# Altium project SingleChip-Rev2.PrjPcb (part 5 of 8)

## Sheet Power-1.SchDoc: =ProjectTitle
size A3; Author: Jaime I. Chait; Organization: NWES LLC; Address1: 111 SW 5th Ave, STE 3150; Address2: Portland, OR 97204; DocumentNumber: SCH-0001; Revision: 2; SheetNumber: 2; SheetTotal: 19
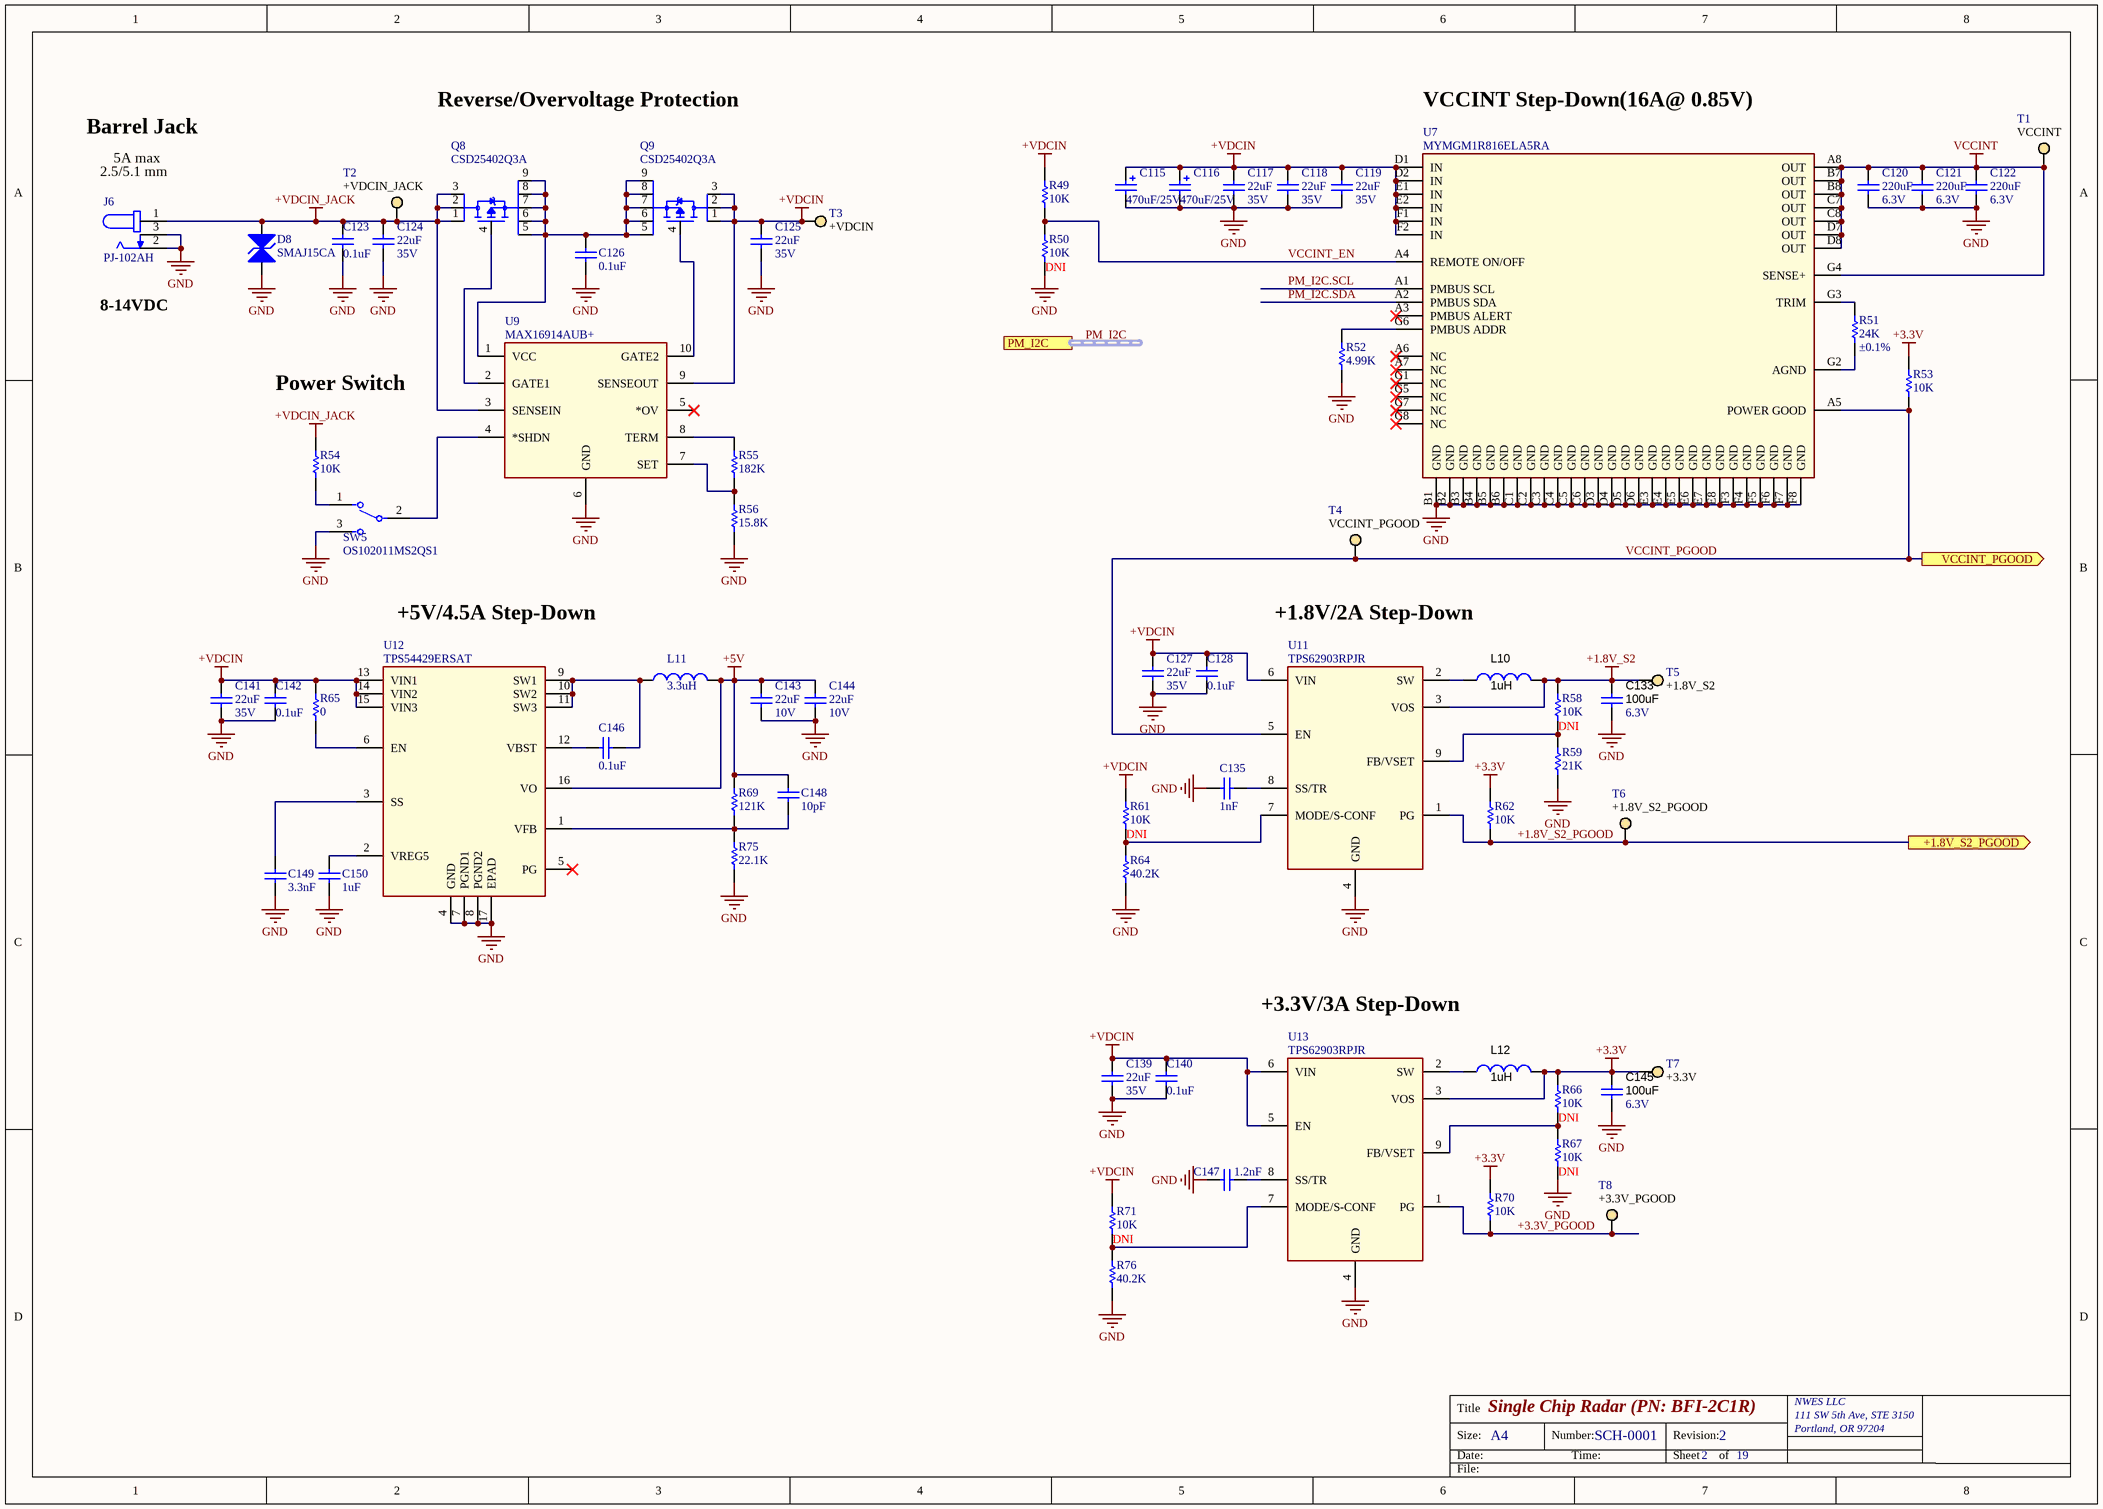
[diagram p11: Power-1.SchDoc]

### Parts
C115  470uF/25V  [Panasonic EEE Size G]
C116  470uF/25V  [Panasonic EEE Size G]
C117  22uF  Voltage Rating: 35V  [CAPC3216X180N]
C118  22uF  Voltage Rating: 35V  [CAPC3216X180N]
C119  22uF  Voltage Rating: 35V  [CAPC3216X180N]
C120  220uF  Voltage Rating (DC): 6.3V  [CAPC3216X180N]
C121  220uF  Voltage Rating (DC): 6.3V  [CAPC3216X180N]
C122  220uF  Voltage Rating (DC): 6.3V  [CAPC3216X180N]
C123  0.1uF  [CAPC1005X55USR]
C124  22uF  Voltage Rating: 35V  [CAPC3216X180N]
C125  22uF  Voltage Rating: 35V  [CAPC3216X180N]
C126  0.1uF  [CAPC1005X55USR]
C127  22uF  Voltage Rating: 35V  [CAPC3216X180N]
C128  0.1uF  [CAPC1005X55USR]
C133  100uF  Voltage Rating (DC): 6.3V  [CAPC3216X180N]
C135  1nF  [CAPC1005X55USR]
C139  22uF  Voltage Rating: 35V  [CAPC3216X180N]
C140  0.1uF  [CAPC1005X55USR]
C141  22uF  Voltage Rating: 35V  [CAPC3216X180N]
C142  0.1uF  [CAPC1005X55USR]
C143  22uF  Voltage Rating: 10V  [CAPC1608X100N]
C144  22uF  Voltage Rating: 10V  [CAPC1608X100N]
C145  100uF  Voltage Rating (DC): 6.3V  [CAPC3216X180N]
C146  0.1uF  [CAPC1005X55USR]
C147  1.2nF  [CAPC1005X55USR]
C148  10pF  [CAPC1005X55USR]
C149  3.3nF  [CAPC1005X55USR]
C150  1uF  [CAPC1005X55USR]
D8  SMAJ15CA  [DIODE DO-214AC(SMA)]
J6  PJ-102AH  [CUI_PJ-102AH]
L10  1uH  [DFE252012P]
L11  3.3uH  [IND_IHLP-3232DZ_VIS]
L12  1uH  [DFE252012P]
Q8  CSD25402Q3A  [8-VSONP (3x3.15)]
Q9  CSD25402Q3A  [8-VSONP (3x3.15)]
R49  10K  [RESC1005X40USR]
R50  10K  [RESC1005X40USR]
R51  24K  Tolerance: ±0.1%  [RESC1005X40USR]
R52  4.99K  [RESC1005X40USR]
R53  10K  [RESC1005X40USR]
R54  10K  [RESC1005X40USR]
R55  182K  [RESC1005X40USR]
R56  15.8K  [RESC1005X40USR]
R58  10K  [RESC1005X40USR]
R59  21K  [RESC1005X40USR]
R61  10K  [RESC1005X40USR]
R62  10K  [RESC1005X40USR]
R64  40.2K  [RESC1005X40USR]
R65  0  [RESC1005X40USR]
R66  10K  [RESC1005X40USR]
R67  10K  [RESC1005X40USR]
R69  121K  [RESC1005X40USR]
R70  10K  [RESC1005X40USR]
R71  10K  [RESC1005X40USR]
R75  22.1K  [RESC1005X40USR]
R76  40.2K  [RESC1005X40USR]
SW5  OS102011MS2QS1  [SW_OS102011MS2QS1]
T1  Parameter 1: VCCINT  [TP_SM_1MM]  (hidden comment: TP_S)  (no BOM)
T2  Parameter 1: +VDCIN_JACK  [TP_SM_1MM]  (hidden comment: TP_S)  (no BOM)
T3  Parameter 1: +VDCIN  [TP_SM_1MM]  (hidden comment: TP_S)  (no BOM)
T4  Parameter 1: VCCINT_PGOOD  [TP_SM_1MM]  (hidden comment: TP_S)  (no BOM)
T5  Parameter 1: +1.8V_S2  [TP_SM_1MM]  (hidden comment: TP_S)  (no BOM)
T6  Parameter 1: +1.8V_S2_PGOOD  [TP_SM_1MM]  (hidden comment: TP_S)  (no BOM)
T7  Parameter 1: +3.3V  [TP_SM_1MM]  (hidden comment: TP_S)  (no BOM)
T8  Parameter 1: +3.3V_PGOOD  [TP_SM_1MM]  (hidden comment: TP_S)  (no BOM)
U7  MYMGM1R816ELA5RA  [56-SMD Module]
U9  MAX16914AUB+  [10-TFSOP]
U11  TPS62903RPJR  [9-VQFN-HR (1.5x2)]
U12  TPS54429ERSAT  [16-QFN (4x4)]
U13  TPS62903RPJR  [9-VQFN-HR (1.5x2)]

### Ports
+1.8V_S2_PGOOD (out), PM_I2C (harness I2C), VCCINT_PGOOD (out)

### Nets
+1.8V_S2: C133.1 L10.2 R58.2 T5.1 U11.3(VOS)
+3.3V: C145.1 L12.2 R53.2 R62.2 R66.2 R70.2 T7.1 U13.3(VOS)
+5V: C143.1 C144.1 C148.2 L11.2 R69.2 U12.16(VO)
+VDCIN: C115.1 C116.1 C117.1 C118.1 C119.1 C125.1 C127.1 C128.2 C139.1 C140.2 C141.1 C142.2 Q9.1(D) Q9.2(D) Q9.3(D) R49.2 R61.2 R65.2 R71.2 T3.1 U7.D1(IN) U7.D2(IN) U7.E1(IN) U7.E2(IN) U7.F1(IN) U7.F2(IN) U9.9(SENSEOUT) U11.6(VIN) U12.13(VIN1) U12.14(VIN2) U12.15(VIN3) U13.5(EN) U13.6(VIN)
+VDCIN_JACK: C123.2 C124.1 D8.1 J6.1 Q8.1(D) Q8.2(D) Q8.3(D) R54.2 T2.1 U9.3(SENSEIN)
GND: C115.2 C116.2 C117.2 C118.2 C119.2 C120.2 C121.2 C122.2 C123.1 C124.2 C125.2 C126.1 C127.2 C128.1 C133.2 C135.1 C139.2 C140.1 C141.2 C142.1 C143.2 C144.2 C145.2 C147.1 C149.1 C150.1 D8.2 J6.2 J6.3 R50.1 R52.1 R56.1 R59.1 R64.1 R67.1 R75.1 R76.1 SW5.3 U7.B1(GND) U7.B2(GND) U7.B3(GND) U7.B4(GND) U7.B5(GND) U7.B6(GND) U7.C1(GND) U7.C2(GND) U7.C3(GND) U7.C4(GND) U7.C5(GND) U7.C6(GND) U7.D3(GND) U7.D4(GND) U7.D5(GND) U7.D6(GND) U7.E3(GND) U7.E4(GND) U7.E5(GND) U7.E6(GND) U7.E7(GND) U7.E8(GND) U7.F3(GND) U7.F4(GND) U7.F5(GND) U7.F6(GND) U7.F7(GND) U7.F8(GND) U9.6(GND) U11.4(GND) U12.4(GND) U12.7(PGND1) U12.8(PGND2) U12.17(EPAD) U13.4(GND)
VCCINT: C120.1 C121.1 C122.1 T1.1 U7.A8(OUT) U7.B7(OUT) U7.B8(OUT) U7.C7(OUT) U7.C8(OUT) U7.D7(OUT) U7.D8(OUT) U7.G4(SENSE+)
+1.8V_S2_PGOOD: R62.1 T6.1 U11.1(PG) ; port +1.8V_S2_PGOOD
+3.3V_PGOOD: R70.1 T8.1 U13.1(PG)
PM_I2C.SCL: U7.A1(PMBUS_SCL)
PM_I2C.SDA: U7.A2(PMBUS_SDA)
VCCINT_EN: R49.1 R50.2 U7.A4(REMOTE_ON/OFF)
VCCINT_PGOOD: R53.1 T4.1 U7.A5(POWER_GOOD) U11.5(EN) ; port VCCINT_PGOOD
NetC126_2: C126.2 Q8.5(S) Q8.6(S) Q8.7(S) Q8.8(S) Q8.9(S) Q9.5(S) Q9.6(S) Q9.7(S) Q9.8(S) Q9.9(S) U9.1(VCC)
NetC135_2: C135.2 U11.8(SS/TR)
NetC146_1: C146.1 L11.1 U12.9(SW1) U12.10(SW2) U12.11(SW3)
NetC146_2: C146.2 U12.12(VBST)
NetC147_2: C147.2 U13.8(SS/TR)
NetC148_1: C148.1 R69.1 R75.2 U12.1(VFB)
NetC149_2: C149.2 U12.3(SS)
NetC150_2: C150.2 U12.2(VREG5)
NetL10_1: L10.1 U11.2(SW)
NetL12_1: L12.1 U13.2(SW)
NetQ8_4: Q8.4(G) U9.2(GATE1)
NetQ9_4: Q9.4(G) U9.10(GATE2)
NetR51_1: R51.1 U7.G2(AGND)
NetR51_2: R51.2 U7.G3(TRIM)
NetR52_2: R52.2 U7.G6(PMBUS_ADDR)
NetR54_1: R54.1 SW5.1
NetR55_1: R55.1 R56.2 U9.7(SET)
NetR55_2: R55.2 U9.8(TERM)
NetR58_1: R58.1 R59.2 U11.9(FB/VSET)
NetR61_1: R61.1 R64.2 U11.7(MODE/S-CONF)
NetR65_1: R65.1 U12.6(EN)
NetR66_1: R66.1 R67.2 U13.9(FB/VSET)
NetR71_1: R71.1 R76.2 U13.7(MODE/S-CONF)
NetSW5_2: SW5.2 U9.4(*SHDN)

Not connected (* = marked no-connect by the designer): U7 A3(PMBUS_ALERT)* A6(NC)* A7(NC)* G1(NC)* G5(NC)* G7(NC)* G8(NC)*; U9 5(*OV)*; U12 5(PG)*

### Buses and harness runs
harness PM_I2C = port PM_I2C

### Notes on the sheet
- Reverse/Overvoltage Protection
- VCCINT Step-Down(16A@ 0.85V)
- Barrel Jack
- (near J6) 2.5/5.1 mm
- 5A max
- (near J6) 8-14VDC
- (near R50) DNI
- Power Switch
- +5V/4.5A Step-Down
- +1.8V/2A Step-Down
- (near R58) DNI
- (near R61) DNI
- +3.3V/3A Step-Down
- (near R66) DNI
- (near R67) DNI
- (near R71) DNI
- Title
- Size:
- Date:
- A4
- Number:
- Time:
- Revision:
- Sheet
- of
- File:

### Library data of the parts
C115 C116 = CAP ALUM POLY 470UF 20% 25V SMD: Conductive Polymer Hybrid Aluminum Electrolytic Capacitors, 470µF, 25V, -55 to 125¡C; Manufacturer: Panasonic; Manufacturer Part Number: EEHZK1E471P; Capacitance: 470uF; Tolerance: 20%; ESR (Equivalent Series Resistance): 20mR; Life (Hours): 4000Hour; Supplier 1: Newark; RoHS: Yes; Category: Aluminum Electrolytic Capacitors; Stock 1: 9500; Pricing 1: 1=1.20000, 500=1.20000 (USD); Mount: Surface Mount; Case/Package: Radial; Min Operating Temperature: -55°C; Max Operating Temperature: 125°C; Resistor Type: Hybrid; Packaging: Cut Tape; Voltage Rating: 25V; Ratings: AEC-Q200; RoHS Compliant: Yes; ComponentLink1URL: https://industrial.panasonic.com/cdbs/www-data/pdf/RDD0000/DMD0000COL81.pdf?src-supplier=Digi-Key; ComponentLink1Description: https://industrial.panasonic.com/cdbs/www-data/pdf/RDD0000/DMD0000COL81.pdf?src-supplier=Digi-Key; ComponentLink2URL: https://industrial.panasonic.com/cdbs/www-data/pdf/RDD0000/ABA0000C1229.pdf?src-supplier=Digi-Key; ComponentLink2Description: https://industrial.panasonic.com/cdbs/www-data/pdf/RDD0000/ABA0000C1229.pdf?src-supplier=Digi-Key; ComponentLink3URL: http://industrial.panasonic.com/cdbs/www-data/pdf/RDD0000/ABA0000C1229.pdf?src-supplier=Farnell; ComponentLink3Description: http://industrial.panasonic.com/cdbs/www-data/pdf/RDD0000/ABA0000C1229.pdf?src-supplier=Farnell; Supplier Part Number 1: 65AH6364
C117-C119 C124 C125 C127 C139 C141 = CAP CER 22UF 35V X5R 1206: C Series 1206 22 uF 35 V ±20 % Tolerance X5R SMT Multilayer Ceramic Capacitor; Manufacturer: TDK; Manufacturer Part Number: C3216X5R1V226M160AC; Tolerance: 20%; Supplier 1: Digi-Key; RoHS: Yes; Category: Ceramic Capacitors; Stock 1: 1100049; Pricing 1: 1=0.95000, 10=0.72200, 50=0.60000, 100=0.51660, 500=0.39996, 1000=0.34441 (USD); Mount: Surface Mount; Case/Package: 1206; Case Code (Metric): 3216; Case Code (Imperial): 1206; Weight: 0.000571oz; Dielectric Material: Ceramic; Min Operating Temperature: -55°C; Max Operating Temperature: 85°C; Capacitance: 22uF; Packaging: Tape and Reel; Termination: SMD/SMT; Series: C; Package Quantity: 2000; Voltage Rating (DC): 35V; Dielectric: X5R; Resistor Type: Ceramic; Voltage: 35V; Construction: Flat; Length: 3.2mm; Width: 0.063inch; Height: 1.6mm; Depth: 1.6mm; Thickness: 1.6mm; Radiation Hardening: No; Lead Free: Lead Free; RoHS Compliant: Yes; ComponentLink1URL: https://datasheet.ciiva.com/24216/c3216x5r1v226m160ac-265035-24216573.pdf?src-supplier=Mouser; ComponentLink1Description: https://datasheet.ciiva.com/24216/c3216x5r1v226m160ac-265035-24216573.pdf?src-supplier=Mouser; ComponentLink2URL: https://datasheet.ciiva.com/23803/1796654-23803046.pdf?src-supplier=Newark; ComponentLink2Description: https://datasheet.ciiva.com/23803/1796654-23803046.pdf?src-supplier=Newark; ComponentLink3URL: https://datasheet.ciiva.com/22725/1913358-22725591.pdf?src-supplier=Element14; ComponentLink3Description: https://datasheet.ciiva.com/22725/1913358-22725591.pdf?src-supplier=Element14; ComponentLink4URL: https://datasheet.ciiva.com/22725/1913358-22725592.pdf?src-supplier=Element14; ComponentLink4Description: https://datasheet.ciiva.com/22725/1913358-22725592.pdf?src-supplier=Element14; ComponentLink5URL: https://datasheet.ciiva.com/6259/tdkmlcccaprange-6259231.pdf?src-supplier=Digi-Key; ComponentLink5Description: https://datasheet.ciiva.com/6259/tdkmlcccaprange-6259231.pdf?src-supplier=Digi-Key; Supplier Part Number 1: 445-8045-1-ND
C120-C122 = CAP CER 220UF 6.3V X5R 1206: 1206 220 uF 6.3 V ±20% Tolernace X5R Multilayer Ceramic Capacitor; Manufacturer: Murata; Manufacturer Part Number: GRM31CR60J227ME11L; Supplier 1: Digi-Key; RoHS: Yes; Category: Ceramic Capacitors; Stock 1: 642908; Pricing 1: 1=1.15000, 10=0.90900, 50=0.78780, 100=0.68180, 500=0.51516, 1000=0.45455 (USD); Mount: Surface Mount; Case/Package: 1206; Case Code (Metric): 3216; Case Code (Imperial): 1206; Min Operating Temperature: -55°C; Max Operating Temperature: 85°C; Packaging: Cut Tape; Voltage Rating: 6.3V; Dielectric: X5R; Tolerance: 20%; Capacitance: 220uF; Series: GRM; Length: 0.126inch; Width: 0.063inch; Thickness: 0.075inch; Reach SVHC Compliant: Yes; RoHS Compliant: Yes; ComponentLink1URL: http://www.farnell.com/datasheets/2867879.pdf?src-supplier=Farnell; ComponentLink1Description: http://www.farnell.com/datasheets/2867879.pdf?src-supplier=Farnell; ComponentLink2URL: http://www.farnell.com/datasheets/2867879.pdf?src-supplier=Element14; ComponentLink2Description: http://www.farnell.com/datasheets/2867879.pdf?src-supplier=Element14; ComponentLink3URL: http://search.murata.co.jp/Ceramy/image/img/A01X/G101/ENG/GRM31CR60J227ME11-01.pdf?src-supplier=Digi-Key; ComponentLink3Description: http://search.murata.co.jp/Ceramy/image/img/A01X/G101/ENG/GRM31CR60J227ME11-01.pdf?src-supplier=Digi-Key; ComponentLink4URL: http://search.murata.co.jp/Ceramy/image/img/A01X/partnumbering_e_01.pdf?src-supplier=Digi-Key; ComponentLink4Description: http://search.murata.co.jp/Ceramy/image/img/A01X/partnumbering_e_01.pdf?src-supplier=Digi-Key; ComponentLink5URL: http://www.farnell.com/datasheets/1957826.pdf?src-supplier=Newark; ComponentLink5Description: http://www.farnell.com/datasheets/1957826.pdf?src-supplier=Newark; Supplier Part Number 1: 490-13970-1-ND
C123 C126 C128 C140 C142 C146 = CAP CER 0.1UF 25V X5R 0402: Manufacturer Part Number: CL05A104KA5NNNC; Manufacturer: Samsung Electro-Mechanics; Supplier Part Number 1: 1276-1043-1-ND; Package: 0402; Height: 0.55mm; Supplier 1: Digi-Key; value: 0.1uF
C133 C145 = CAP CER 100UF 6.3V X5R 1206: 1206 100 uF 6.3 V ±20% Tolerance X5R SMT Multilayer Ceramic Capacitor; Manufacturer: Murata; Manufacturer Part Number: GRM31CR60J107ME39L; Supplier 1: Mouser; RoHS: Yes; Category: Ceramic Capacitors; Stock 1: 589630; Pricing 1: 1=1.08000, 10=0.79300, 50=0.79300, 100=0.54400, 1000=0.53900, 10000=0.44000 (USD); Mount: Surface Mount; Case/Package: 1206; Case Code (Metric): 3216; Case Code (Imperial): 1206; Min Operating Temperature: -55°C; Max Operating Temperature: 85°C; Packaging: Cut Tape; Voltage Rating: 6.3V; Dielectric: X5R; Tolerance: 20%; Capacitance: 100uF; Series: GRM; Length: 3.2mm; Width: 1.6mm; Thickness: 0.071inch; Reach SVHC Compliant: Yes; RoHS Compliant: Yes; ComponentLink1URL: https://datasheet.ciiva.com/142/grm31cr60j107me39-01-142571.pdf?src-supplier=Digi-Key; ComponentLink1Description: https://datasheet.ciiva.com/142/grm31cr60j107me39-01-142571.pdf?src-supplier=Digi-Key; ComponentLink2URL: https://datasheet.ciiva.com/142/grm31cr60j107me39-01-142572.pdf?src-supplier=Digi-Key; ComponentLink2Description: https://datasheet.ciiva.com/142/grm31cr60j107me39-01-142572.pdf?src-supplier=Digi-Key; ComponentLink3URL: https://datasheet.ciiva.com/3776/255grm31cr60j107me3923-3776999.pdf?src-supplier=Arrow+Electronics; ComponentLink3Description: https://datasheet.ciiva.com/3776/255grm31cr60j107me3923-3776999.pdf?src-supplier=Arrow+Electronics; ComponentLink4URL: https://datasheet.ciiva.com/11787/0900766b80ef921d-11787809.pdf?src-supplier=Rs; ComponentLink4Description: https://datasheet.ciiva.com/11787/0900766b80ef921d-11787809.pdf?src-supplier=Rs; ComponentLink5URL: https://datasheet.ciiva.com/29202/451152-da-01-de-vs-chip-kond-1206-100-0-uf-20pr-6-3v-x5r-29202463.pdf?src-supplier=Conrad; ComponentLink5Description: https://datasheet.ciiva.com/29202/451152-da-01-de-vs-chip-kond-1206-100-0-uf-20pr-6-3v-x5r-29202463.pdf?src-supplier=Conrad; Supplier Part Number 1: 81-GRM31CR60J107ME9L; Material: Ceramic; Weight: 0.001411oz; Package Quantity: 2000; Termination: Standard; Voltage: 6.3V; Height: 1.6mm; Depth: 1.6mm; Radiation Hardening: No; Lead Free: Lead Free; ComponentLink6URL: https://datasheet.ciiva.com/29199/454804-da-01-en-vs-kondensator-1206-29199543.pdf?src-supplier=Conrad; ComponentLink6Description: https://datasheet.ciiva.com/29199/454804-da-01-en-vs-kondensator-1206-29199543.pdf?src-supplier=Conrad; ComponentLink7URL: https://datasheet.ciiva.com/14116/grmseries-highdielectrictype-eng-14116431.pdf?src-supplier=Distrelec; ComponentLink7Description: https://datasheet.ciiva.com/14116/grmseries-highdielectrictype-eng-14116431.pdf?src-supplier=Distrelec; ComponentLink8URL: https://datasheet.ciiva.com/142/grm31cr60j107me39-01-142570.pdf?src-supplier=Digi-Key; ComponentLink8Description: https://datasheet.ciiva.com/142/grm31cr60j107me39-01-142570.pdf?src-supplier=Digi-Key; ComponentLink9URL: https://datasheet.ciiva.com/5416/product-5416441.pdf?src-supplier=Mouser; ComponentLink9Description: https://datasheet.ciiva.com/5416/product-5416441.pdf?src-supplier=Mouser; ComponentLink10URL: https://datasheet.ciiva.com/16461/product-16461259.pdf?src-supplier=Future+Electronics; ComponentLink10Description: https://datasheet.ciiva.com/16461/product-16461259.pdf?src-supplier=Future+Electronics
C135 = CAP CER 1000PF 50V C0G/NP0 0402: 0402 1000 pF 50 V ±5% Tolerance C0G Multilayer Ceramic Chip Capacitor; Manufacturer: Murata; Manufacturer Part Number: GRM1555C1H102JA01D; Voltage Rating: 50V; Insulation Resistance: 10GR; Temperature Coefficient: 30ppm/°C; Supplier 1: Digi-Key; RoHS: Yes; Category: Ceramic Capacitors; Stock 1: 27788485; Pricing 1: 1=0.10000, 10=0.03900, 50=0.02120, 100=0.01740, 500=0.01240, 1000=0.00975, 2500=0.00886, 5000=0.00815 (USD); Mount: Surface Mount; Case/Package: 0402; Number of Pins: 2; Case Code (Metric): 1005; Case Code (Imperial): 0402; Material: Ceramic; Dielectric Material: Ceramic; Min Operating Temperature: -55°C; Max Operating Temperature: 125°C; Package Quantity: 1; Capacitance: 1nF; Tolerance: 5%; Packaging: Tape and Reel; Voltage Rating (DC): 50V; Dielectric: C0G; Termination: SMD/SMT; Voltage: 50V; Series: GRM; Construction: Flat; Length: 1mm; Width: 0.5mm; Height: 0.5mm; Thickness: 0.022inch; Depth: 0.5mm; Size: 0.5mm; Radiation Hardening: No; Reach SVHC Compliant: Yes; Lead Free: Lead Free; RoHS Compliant: Yes; ComponentLink1URL: https://datasheet.ciiva.com/34302/1855908-34302849.pdf?src-supplier=Jameco; ComponentLink1Description: https://datasheet.ciiva.com/34302/1855908-34302849.pdf?src-supplier=Jameco; ComponentLink2URL: https://datasheet.ciiva.com/132/product-132800.pdf?src-supplier=Digi-Key; ComponentLink2Description: https://datasheet.ciiva.com/132/product-132800.pdf?src-supplier=Digi-Key; ComponentLink3URL: https://datasheet.ciiva.com/132/grm1555c1h102ja01-01-132799.pdf?src-supplier=Digi-Key; ComponentLink3Description: https://datasheet.ciiva.com/132/grm1555c1h102ja01-01-132799.pdf?src-supplier=Digi-Key; ComponentLink4URL: https://datasheet.ciiva.com/11786/0900766b807a1cab-11786727.pdf?src-supplier=RSComponents; ComponentLink4Description: https://datasheet.ciiva.com/11786/0900766b807a1cab-11786727.pdf?src-supplier=RSComponents; ComponentLink5URL: https://datasheet.ciiva.com/29200/453569-da-01-en-vs-kondensator-0402-29200121.pdf?src-supplier=Conrad; ComponentLink5Description: https://datasheet.ciiva.com/29200/453569-da-01-en-vs-kondensator-0402-29200121.pdf?src-supplier=Conrad; ComponentLink6URL: https://datasheet.ciiva.com/7828/4360-7828821.pdf?src-supplier=Element14; ComponentLink6Description: https://datasheet.ciiva.com/7828/4360-7828821.pdf?src-supplier=Element14; ComponentLink7URL: https://datasheet.ciiva.com/14116/grmseries-tc-hitype-eng-14116919.pdf?src-supplier=Distrelec; ComponentLink7Description: https://datasheet.ciiva.com/14116/grmseries-tc-hitype-eng-14116919.pdf?src-supplier=Distrelec; ComponentLink8URL: https://datasheet.ciiva.com/14116/grmseries-tc-hitype-eng-14116858.pdf?src-supplier=Distrelec; ComponentLink8Description: https://datasheet.ciiva.com/14116/grmseries-tc-hitype-eng-14116858.pdf?src-supplier=Distrelec; ComponentLink9URL: https://datasheet.ciiva.com/132/grm1555c1h102ja01-01-132801.pdf?src-supplier=Digi-Key; ComponentLink9Description: https://datasheet.ciiva.com/132/grm1555c1h102ja01-01-132801.pdf?src-supplier=Digi-Key; ComponentLink10URL: https://datasheet.ciiva.com/7828/1747436-7828822.pdf?src-supplier=Element14; ComponentLink10Description: https://datasheet.ciiva.com/7828/1747436-7828822.pdf?src-supplier=Element14; Supplier Part Number 1: 490-3244-1-ND
C143 C144 = CAP CER 22UF 10V X5R 0603: Multilayer Ceramic Capacitor, 22 uF, 10 V, ± 20%, X5R, 0603 [1608 Metric]; Manufacturer: TDK; Manufacturer Part Number: C1608X5R1A226M080AC; Supplier 1: Digi-Key; RoHS: Yes; Category: Ceramic Capacitors; Stock 1: 4100481; Pricing 1: 1=0.45000, 10=0.31300, 50=0.21920, 100=0.18790, 500=0.14090, 1000=0.11898 (USD); Mount: Surface Mount; Case/Package: 0603; Case Code (Metric): 1608; Case Code (Imperial): 0603; Dielectric Material: Ceramic; Weight: 7.1E-05oz; Min Operating Temperature: -55°C; Max Operating Temperature: 85°C; Tolerance: 20%; Capacitance: 22uF; Packaging: Tape and Reel; Voltage Rating (DC): 10V; Termination: SMD/SMT; Series: C; Package Quantity: 4000; Dielectric: X5R; Resistor Type: Ceramic; Length: 1.6mm; Width: 0.8mm; Height: 0.8mm; Thickness: 0.035inch; Depth: 0.8mm; Reach SVHC Compliant: Yes; Lead Free: Lead Free; RoHS Compliant: Yes; ComponentLink1URL: https://datasheet.ciiva.com/6274/tdkmlcccaprange-6274860.pdf?src-supplier=Digi-Key; ComponentLink1Description: https://datasheet.ciiva.com/6274/tdkmlcccaprange-6274860.pdf?src-supplier=Digi-Key; ComponentLink2URL: https://datasheet.ciiva.com/6274/tdkmlcccaprange-6274859.pdf?src-supplier=Digi-Key; ComponentLink2Description: https://datasheet.ciiva.com/6274/tdkmlcccaprange-6274859.pdf?src-supplier=Digi-Key; ComponentLink3URL: https://datasheet.ciiva.com/6274/tdkmlcccaprange-6274861.pdf?src-supplier=Digi-Key; ComponentLink3Description: https://datasheet.ciiva.com/6274/tdkmlcccaprange-6274861.pdf?src-supplier=Digi-Key; ComponentLink4URL: https://datasheet.ciiva.com/24216/mlcc-commercial-general-en-24216575.pdf?src-supplier=Mouser; ComponentLink4Description: https://datasheet.ciiva.com/24216/mlcc-commercial-general-en-24216575.pdf?src-supplier=Mouser; Supplier Part Number 1: 445-9077-1-ND
C147 = CAP CER 1200PF 50V X7R 0402: 0402 1.2 nF 50 V ±10% Tolerance X7R SMT Multilayer Ceramic Capacitor; Manufacturer: Murata; Manufacturer Part Number: GRM155R71H122KA01D; Voltage Rating: 50V; Supplier 1: Digi-Key; RoHS: Yes; Category: Ceramic Capacitors; Stock 1: 373559; Pricing 1: 1=0.10000, 10=0.02800, 50=0.01520, 100=0.01240, 500=0.00886, 1000=0.00696, 2500=0.00632, 5000=0.00582 (USD); Mount: Surface Mount; Case/Package: 0402; Case Code (Metric): 1005; Case Code (Imperial): 0402; Material: Ceramic; Min Operating Temperature: -55°C; Max Operating Temperature: 125°C; Capacitance: 1.2nF; Tolerance: 10%; Dielectric: X7R; Packaging: Tape and Reel; Package Quantity: 1; Voltage Rating (DC): 50V; Termination: SMD/SMT; Voltage: 50V; Series: GRM; Construction: Flat; Length: 1mm; Width: 0.5mm; Height: 0.5mm; Thickness: 0.022inch; Depth: 0.5mm; Radiation Hardening: No; Lead Free: Lead Free; RoHS Compliant: Yes; ComponentLink1URL: https://datasheet.ciiva.com/18184/getdatasheetpartid-220777-18184722.pdf?src-supplier=Verical; ComponentLink1Description: https://datasheet.ciiva.com/18184/getdatasheetpartid-220777-18184722.pdf?src-supplier=Verical; ComponentLink2URL: https://datasheet.ciiva.com/161/partnumbering-e-01-161460.pdf?src-supplier=Digi-Key; ComponentLink2Description: https://datasheet.ciiva.com/161/partnumbering-e-01-161460.pdf?src-supplier=Digi-Key; ComponentLink3URL: https://datasheet.ciiva.com/161/partnumbering-e-01-161459.pdf?src-supplier=Digi-Key; ComponentLink3Description: https://datasheet.ciiva.com/161/partnumbering-e-01-161459.pdf?src-supplier=Digi-Key; ComponentLink4URL: https://datasheet.ciiva.com/161/partnumbering-e-01-161461.pdf?src-supplier=Digi-Key; ComponentLink4Description: https://datasheet.ciiva.com/161/partnumbering-e-01-161461.pdf?src-supplier=Digi-Key; ComponentLink5URL: https://datasheet.ciiva.com/2989/product-2989402.pdf?src-supplier=Avnet; ComponentLink5Description: https://datasheet.ciiva.com/2989/product-2989402.pdf?src-supplier=Avnet; Supplier Part Number 1: 490-1304-1-ND
C148 = CAP CER 10PF 50V C0G/NP0 0402: 0402 10 pF 50 V ±5% Tolerance C0G SMT Multilayer Ceramic Capacitor; Manufacturer: Murata; Manufacturer Part Number: GRM1555C1H100JA01D; Voltage Rating: 50V; Temperature Coefficient: 30ppm/°C; Supplier 1: Digi-Key; RoHS: Yes; Category: Ceramic Capacitors; Stock 1: 7638732; Pricing 1: 1=0.10000, 10=0.02200, 50=0.01220, 100=0.00990, 500=0.00708, 1000=0.00556, 2500=0.00505, 5000=0.00465 (USD); Mount: Surface Mount; Case/Package: 0402; Number of Pins: 2; Case Code (Metric): 1005; Case Code (Imperial): 0402; Material: Ceramic; Min Operating Temperature: -55°C; Max Operating Temperature: 125°C; Capacitance: 10pF; Dielectric: C0G; Packaging: Tape and Reel; Package Quantity: 1; Voltage Rating (DC): 50V; Termination: SMD/SMT; Series: GRM; Tolerance: 5%; Voltage: 50V; Construction: Flat; Length: 1mm; Width: 0.02inch; Height: 0.5mm; Thickness: 0.022inch; Depth: 0.5mm; Radiation Hardening: No; RoHS Compliant: Yes; Lead Free: Lead Free; Reach SVHC Compliant: Yes; ComponentLink1URL: https://datasheet.ciiva.com/2989/product-2989280.pdf?src-supplier=Avnet; ComponentLink1Description: https://datasheet.ciiva.com/2989/product-2989280.pdf?src-supplier=Avnet; ComponentLink2URL: https://datasheet.ciiva.com/18184/getdatasheetpartid-307234-18184164.pdf?src-supplier=Verical; ComponentLink2Description: https://datasheet.ciiva.com/18184/getdatasheetpartid-307234-18184164.pdf?src-supplier=Verical; ComponentLink3URL: https://datasheet.ciiva.com/29200/453545-da-01-en-vs-kondensator-0402-29200107.pdf?src-supplier=Conrad; ComponentLink3Description: https://datasheet.ciiva.com/29200/453545-da-01-en-vs-kondensator-0402-29200107.pdf?src-supplier=Conrad; ComponentLink4URL: https://datasheet.ciiva.com/7828/1666664-7828812.pdf?src-supplier=Element14; ComponentLink4Description: https://datasheet.ciiva.com/7828/1666664-7828812.pdf?src-supplier=Element14; ComponentLink5URL: https://datasheet.ciiva.com/6271/partnumbering-e-01-6271159.pdf?src-supplier=Digi-Key; ComponentLink5Description: https://datasheet.ciiva.com/6271/partnumbering-e-01-6271159.pdf?src-supplier=Digi-Key; ComponentLink6URL: https://datasheet.ciiva.com/6271/partnumbering-e-01-6271158.pdf?src-supplier=Digi-Key; ComponentLink6Description: https://datasheet.ciiva.com/6271/partnumbering-e-01-6271158.pdf?src-supplier=Digi-Key; ComponentLink7URL: https://datasheet.ciiva.com/6271/partnumbering-e-01-6271068.pdf?src-supplier=Digi-Key; ComponentLink7Description: https://datasheet.ciiva.com/6271/partnumbering-e-01-6271068.pdf?src-supplier=Digi-Key; ComponentLink8URL: https://datasheet.ciiva.com/48671/product-48671350.pdf?src-supplier=Avnet; ComponentLink8Description: https://datasheet.ciiva.com/48671/product-48671350.pdf?src-supplier=Avnet; Supplier Part Number 1: 490-5921-1-ND
C149 = CAP CER 3300PF 50V X7R 0402: 0402 3.3 nF 50 V ±10% Tolerance X7R SMT Multilayer Ceramic Capacitor; Manufacturer: Murata; Manufacturer Part Number: GRM155R71H332KA01D; Voltage Rating (DC): 50V; Dissipation Factor: 0.025%; Insulation Resistance: 10GR; Supplier 1: Digi-Key; RoHS: Yes; Category: Ceramic Capacitors; Stock 1: 1429301; Pricing 1: 1=0.10000, 10=0.02800, 50=0.01520, 100=0.01240, 500=0.00886, 1000=0.00696, 2500=0.00632, 5000=0.00582 (USD); Mount: Surface Mount; Case/Package: 0402; Case Code (Metric): 1005; Case Code (Imperial): 0402; Material: Ceramic; Min Operating Temperature: -55°C; Max Operating Temperature: 125°C; Capacitance: 3.3nF; Tolerance: 10%; Package Quantity: 1; Packaging: Tape and Reel; Voltage Rating: 50V; Dielectric: X7R; Termination: SMD/SMT; Voltage: 50V; Series: GRM; Construction: Flat; Length: 1mm; Width: 0.02inch; Height: 0.5mm; Thickness: 0.022inch; Depth: 0.5mm; Radiation Hardening: No; Reach SVHC Compliant: Yes; Lead Free: Lead Free; RoHS Compliant: Yes; ComponentLink1URL: https://datasheet.ciiva.com/129/grm155r71h332ka01-01-129766.pdf?src-supplier=Digi-Key; ComponentLink1Description: https://datasheet.ciiva.com/129/grm155r71h332ka01-01-129766.pdf?src-supplier=Digi-Key; ComponentLink2URL: https://datasheet.ciiva.com/129/grm155r71h332ka01-01-129767.pdf?src-supplier=Digi-Key; ComponentLink2Description: https://datasheet.ciiva.com/129/grm155r71h332ka01-01-129767.pdf?src-supplier=Digi-Key; ComponentLink3URL: https://datasheet.ciiva.com/11789/0900766b80ef921d-11789161.pdf?src-supplier=RSComponents; ComponentLink3Description: https://datasheet.ciiva.com/11789/0900766b80ef921d-11789161.pdf?src-supplier=RSComponents; ComponentLink4URL: https://datasheet.ciiva.com/5422/product-5422403.pdf?src-supplier=Mouser; ComponentLink4Description: https://datasheet.ciiva.com/5422/product-5422403.pdf?src-supplier=Mouser; ComponentLink5URL: https://datasheet.ciiva.com/18184/getdatasheetpartid-149678-18184747.pdf?src-supplier=Verical; ComponentLink5Description: https://datasheet.ciiva.com/18184/getdatasheetpartid-149678-18184747.pdf?src-supplier=Verical; ComponentLink6URL: https://datasheet.ciiva.com/29199/454326-da-01-en-vs-kondensator-0402-29199651.pdf?src-supplier=Conrad; ComponentLink6Description: https://datasheet.ciiva.com/29199/454326-da-01-en-vs-kondensator-0402-29199651.pdf?src-supplier=Conrad; ComponentLink7URL: https://datasheet.ciiva.com/14116/grmseries-highdielectrictype-eng-14116909.pdf?src-supplier=Distrelec; ComponentLink7Description: https://datasheet.ciiva.com/14116/grmseries-highdielectrictype-eng-14116909.pdf?src-supplier=Distrelec; ComponentLink8URL: https://datasheet.ciiva.com/2989/product-2989413.pdf?src-supplier=Avnet; ComponentLink8Description: https://datasheet.ciiva.com/2989/product-2989413.pdf?src-supplier=Avnet; ComponentLink9URL: https://datasheet.ciiva.com/16199/product-16199259.pdf?src-supplier=Future+Electronics; ComponentLink9Description: https://datasheet.ciiva.com/16199/product-16199259.pdf?src-supplier=Future+Electronics; ComponentLink10URL: https://datasheet.ciiva.com/48671/product-48671326.pdf?src-supplier=Avnet; ComponentLink10Description: https://datasheet.ciiva.com/48671/product-48671326.pdf?src-supplier=Avnet; Supplier Part Number 1: 490-3248-1-ND
C150 = CAP CER 1UF 25V X5R 0402: Manufacturer Part Number: GRM155R61E105MA12D; Manufacturer: Murata Electronics; Part #: E-CAP-042; Supplier Part Number 1: 490-10018-1-ND; Package: 0402; value: 1uF; Supplier 1: Digi-Key; Height: 0.55mm; ComponentLink1Description: New link; ComponentLink1URL: *
D8 = D_TVS_SMAJ15CA: Diode TVS Single Uni-Dir/Bi-Dir 15V 400W 2-Pin SMA Carrier T/R; Manufacturer: Littelfuse; Polarity: Bidirectional; Clamping Voltage: 24.4V; Breakdown Voltage: 16.7V; Peak Pulse Current: 16.4A; Test Current: 1mA; Number of Elements: 1; Max Power Dissipation: 3.3W; Leakage Current: 1uA; Power Line Protection: No; Diode Type: ZENER; Max Breakdown Voltage: 18.5V; Supplier 1: Digi-Key; Manufacturer Part Number: SMAJ15CA; RoHS: Yes; Category: TVS Diodes; Stock 1: 491414; Pricing 1: 1=0.43000, 10=0.32000, 100=0.19950, 500=0.13650, 1000=0.10500, 2000=0.09450 (USD); Mount: Surface Mount; Case/Package: DO-214AC; Number of Pins: 2; Min Operating Temperature: -65°C; Max Operating Temperature: 150°C; Packaging: Tape and Reel; Peak Pulse Power: 400W; Reverse Standoff Voltage: 15V; Max Surge Current: 16.4A; Package Quantity: 5000; Min Breakdown Voltage: 16.7V; Operating Supply Voltage: 15V; Reverse Breakdown Voltage: 16.7V; Direction: Bidirectional; Number of Channels: 1; Termination: SMD/SMT; Number of Bidirectional Channels: 1; Max Reverse Leakage Current: 1uA; Element Configuration: Single; Voltage Rating (DC): 15V; Resistor Type: Zener; Series: SMAJ; Power Dissipation: 400W; Clamping Voltage-Max: 24.4V; Length: 4.5mm; Width: 2.79mm; Height: 2.087mm; Radiation Hardening: No; RoHS Compliant: Yes; Lead Free: Lead Free; Reach SVHC Compliant: Yes; ComponentLink1URL: https://datasheet.ciiva.com/25624/0900766b810f4edb-25624840.pdf?src-supplier=RSComponents; ComponentLink1Description: https://datasheet.ciiva.com/25624/0900766b810f4edb-25624840.pdf?src-supplier=RSComponents; ComponentLink2URL: https://datasheet.ciiva.com/331/littelfuse-tvs-diode-smaj-datasheet-pdf-331084.pdf?src-supplier=Digi-Key; ComponentLink2Description: https://datasheet.ciiva.com/331/littelfuse-tvs-diode-smaj-datasheet-pdf-331084.pdf?src-supplier=Digi-Key; ComponentLink3URL: https://datasheet.ciiva.com/331/littelfuse-tvs-diode-smaj-datasheet-pdf-331085.pdf?src-supplier=Digi-Key; ComponentLink3Description: https://datasheet.ciiva.com/331/littelfuse-tvs-diode-smaj-datasheet-pdf-331085.pdf?src-supplier=Digi-Key; ComponentLink4URL: https://datasheet.ciiva.com/331/littelfuse-tvs-diode-smaj-datasheet-pdf-331086.pdf?src-supplier=Digi-Key; ComponentLink4Description: https://datasheet.ciiva.com/331/littelfuse-tvs-diode-smaj-datasheet-pdf-331086.pdf?src-supplier=Digi-Key; ComponentLink5URL: https://datasheet.ciiva.com/16487/littelfuse-tvs-diode-smaj-16487445.pdf?src-supplier=Future+Electronics; ComponentLink5Description: https://datasheet.ciiva.com/16487/littelfuse-tvs-diode-smaj-16487445.pdf?src-supplier=Future+Electronics; ComponentLink6URL: https://datasheet.ciiva.com/8062/littelfuse-tvs-diode-smaj-8062270.pdf?src-supplier=Element14; ComponentLink6Description: https://datasheet.ciiva.com/8062/littelfuse-tvs-diode-smaj-8062270.pdf?src-supplier=Element14; ComponentLink7URL: https://datasheet.ciiva.com/28473/607617-28473388.pdf?src-supplier=Element14; ComponentLink7Description: https://datasheet.ciiva.com/28473/607617-28473388.pdf?src-supplier=Element14; Supplier Part Number 1: SMAJ15CALFCT-ND
J6 = PJ-102AH: 2.0 x 6.5 mm, 5.0 A, Horizontal, Through Hole, Tapered Pins, Dc Power Jack Connector; Manufacturer: CUI; Gender: Male; Shielding: Unshielded; Current Rating: 5A; Voltage Rating: 24V; Insulation Resistance: 50MR; Number of Conductors: 2; Supplier 1: Digi-Key; Manufacturer Part Number: PJ-102AH; RoHS: Yes; Category: Uncategorized; Stock 1: 24375; Pricing 1: 1=0.810000, 10=0.686000, 25=0.658000, 40=0.644000, 80=0.616000, 280=0.560000, 560=0.504000, 1120=0.448000, 2520=0.406000 (USD); Mount: Through Hole; Color: Black; Contact Material: Copper; Contact Plating: Nickel; Housing Color: Black; Housing Material: Thermoplastic; Min Operating Temperature: -25°C; Max Operating Temperature: 85°C; Package Quantity: 280; Termination: Through Hole; Connector Type: Jack; Contact Gender: Male; Orientation: Horizontal; Series: -; Packaging: Bulk; Diameter: 2.1mm; Flammability Rating: UL94 V-0; Lead Free: Lead Free; RoHS Compliant: Yes; ComponentLink1URL: http://www.mouser.com/ds/2/670/PJ-102AH-524179.pdf?src-supplier=Mouser; ComponentLink1Description: http://www.mouser.com/ds/2/670/PJ-102AH-524179.pdf?src-supplier=Mouser; ComponentLink2URL: https://www.cui.com/product/resource/digikeypdf/pj-102ah.pdf?src-supplier=Digi-Key; ComponentLink2Description: https://www.cui.com/product/resource/digikeypdf/pj-102ah.pdf?src-supplier=Digi-Key; ComponentLink3URL: http://www.cui.com/Product/Resource/FuturePDF/PJ-102AH.pdf?src-supplier=Future+Electronics; ComponentLink3Description: http://www.cui.com/Product/Resource/FuturePDF/PJ-102AH.pdf?src-supplier=Future+Electronics; Supplier Part Number 1: CP-102AH-ND
L10 L12 = FIXED IND 1UH 3.3A 40 MOHM SMD: Inductor Power Chip Shielded Wirewound 1uH 20% 1MHz Metal 3.3A 0.04Ohm DCR 1008 T/R; Manufacturer: Murata; Manufacturer Part Number: DFE252012F-1R0M=P2; Core Material: Ferrite; Saturation Current: 5.3A; DC Resistance (DCR): 40mR; Supplier 1: Digi-Key; RoHS: Yes; Category: Fixed Inductors; Stock 1: 280963; Pricing 1: 1=0.35000, 10=0.31500, 25=0.27560, 50=0.23640, 100=0.21660, 250=0.19696, 500=0.18514, 1000=0.14180 (USD); Mount: Surface Mount; Case/Package: 1008; Case Code (Metric): 2520; Case Code (Imperial): 1008; Min Operating Temperature: -40°C; Max Operating Temperature: 125°C; Packaging: Tape and Reel; Inductance: 1uH; Current Rating: 3.3A; Shielding: Shielded; Test Frequency: 1MHz; Tolerance: 20%; Length: 0.098inch; Width: 0.079inch; Height - Seated (Max): 0.047inch; RoHS Compliant: Yes; ComponentLink1URL: http://www.farnell.com/datasheets/2616788.pdf?src-supplier=Farnell; ComponentLink1Description: http://www.farnell.com/datasheets/2616788.pdf?src-supplier=Farnell; ComponentLink2URL: https://www.murata.com/~/media/webrenewal/products/inductor/chip/tokoproducts/wirewoundmetalalloychiptype/m_dfe252012f.ashx?src-supplier=Digi-Key; ComponentLink2Description: https://www.murata.com/~/media/webrenewal/products/inductor/chip/tokoproducts/wirewoundmetalalloychiptype/m_dfe252012f.ashx?src-supplier=Digi-Key; Supplier Part Number 1: 490-13053-1-ND
L11 = FIXED IND 3.3UH 9.2A 17.7MOHM SM: Inductor Power Shielded Wirewound 3.3uH 20% 100KHz Powdered Iron 9.2A 17.7mOhm DCR 3232 T/R; Manufacturer: Vishay Dale; Manufacturer Part Number: IHLP3232DZER3R3M01; Core Material: Ferrite; Saturation Current: 20A; Self Resonant Frequency: 25MHz; DC Resistance (DCR): 17.7mR; Supplier 1: Digi-Key; RoHS: Yes; Category: Fixed Inductors; Stock 1: 27353; Pricing 1: 1=1.54000, 10=1.43300, 25=1.32320, 50=1.10240, 100=1.03640, 250=0.92608 (USD); Mount: Surface Mount; Case/Package: 3232; Number of Pins: 2; Contact Plating: Tin; Min Operating Temperature: -55°C; Max Operating Temperature: 125°C; Package Quantity: 1; Current Rating: 9.2A; Tolerance: 20%; Shielding: Shielded; Packaging: Tape and Reel; Inductance Tolerance: 20%; Inductance: 3.3uH; Test Frequency: 100kHz; Max DC Current: 20A; Termination: SMD/SMT; RMS Current (Irms): 9.2A; Series: IHLP-3232DZ-01; Length: 0.34inch; Width: 0.322inch; Height: 4mm; Height - Seated (Max): 0.157inch; Depth: 8.94mm; Radiation Hardening: No; Military Standard: Not; Lead Free: Lead Free; RoHS Compliant: Yes; ComponentLink1URL: https://datasheet.ciiva.com/8017/1817578-8017317.pdf?src-supplier=Element14; ComponentLink1Description: https://datasheet.ciiva.com/8017/1817578-8017317.pdf?src-supplier=Element14; Supplier Part Number 1: 541-1373-1-ND
Q8 Q9 = CSD25402Q3A: MOSFET P-CH 20V 72A 8SON; Manufacturer: Texas Instruments; Rise Time: 7ns; Rds On Max: 8.9mR; Input Capacitance: 1.79nF; Continuous Drain Current (ID): 76A; Max Power Dissipation: 69W; Turn-On Delay Time: 10ns; Turn-Off Delay Time: 25ns; Fall Time: 12ns; Gate to Source Voltage (Vgs): 650mV; Element Configuration: Single; Polarity: P-CHANNEL; Threshold Voltage: 900mV; Number of Channels: 1; Supplier 1: Digi-Key; Manufacturer Part Number: CSD25402Q3A; RoHS: Yes; Category: MOSFETs; Stock 1: 73; Pricing 1: 1=0.98000, 10=0.87600, 100=0.68310, 500=0.56430, 1000=0.44550 (USD); Mount: Surface Mount; Case/Package: VSON; Number of Pins: 8; Contact Plating: Tin; Min Operating Temperature: -55°C; Max Operating Temperature: 150°C; Package Quantity: 2500; Series: NexFET™; Packaging: Cut Tape; Drain to Source Voltage (Vdss): 20V; Drain to Source Breakdown Voltage: 20V; Drain to Source Resistance: 8.9mR; Length: 3.15mm; Width: 3mm; Height: 0.9mm; RoHS Compliant: Yes; Reach SVHC Compliant: Yes; Lead Free: Lead Free; ComponentLink1URL: https://datasheet.ciiva.com/30021/csd25402q3a-30021955.pdf?src-supplier=Avnet; ComponentLink1Description: https://datasheet.ciiva.com/30021/csd25402q3a-30021955.pdf?src-supplier=Avnet; Supplier Part Number 1: 296-38916-1-ND
R49 R50 R53 R54 R58 R61 R62 R66 R67 R70 R71 = RES 10K OHM 1% 1/16W 0402: Manufacturer: YAGEO; Manufacturer Part Number: RC0402FR-0710KL; Supplier Part Number 1: 311-10.0KLRCT-ND; Package: 0402; Height: 0.4mm; Supplier 1: Digi-Key; value: 10K; Tolerance: ±1%
R51 = RES 24K OHM 0.1% 1/16W 0402: RES SMD 24K OHM 0.1% 1/16W 0402; Manufacturer: YAGEO; Manufacturer Part Number: RT0402BRE0724KL; Supplier Part Number 1: YAG4361CT-ND; Supplier 1: Digi-Key; Height: 0.4mm; Package: 0402; value: 24K
R52 = RES 4.99K OHM 1% 1/16W 0402: Manufacturer: YAGEO; Manufacturer Part Number: RC0402FR-074K99L; Supplier Part Number 1: 311-4.99KLRCT-ND; Supplier 1: Digi-Key; Height: 0.4mm; Package: 0402; value: 4.99K
R55 = RES 182K OHM 1% 1/16W 0402: Manufacturer: YAGEO; Manufacturer Part Number: RC0402FR-07182KL; Supplier Part Number 1: YAG3015CT-ND; Supplier 1: Digi-Key; Height: 0.4mm; Package: 0402; value: 182K
R56 = RES 15.8K OHM 1% 1/16W 0402: Manufacturer: YAGEO; Manufacturer Part Number: RC0402FR-0715K8L; Supplier Part Number 1: YAG2993CT-ND; Supplier 1: Digi-Key; Height: 0.4mm; Package: 0402; value: 15.8K
R59 = RES 21K OHM 1% 1/16W 0402: Manufacturer: YAGEO; Manufacturer Part Number: RC0402FR-0721KL; Supplier Part Number 1: 311-21.0KLRCT-ND; Supplier 1: Digi-Key; Height: 0.4mm; Package: 0402; value: 21K
R64 R76 = RES 40.2K OHM 1% 1/16W 0402: Manufacturer: YAGEO; Manufacturer Part Number: RC0402FR-0740K2L; Supplier Part Number 1: 311-40.2KLRCT-ND; Supplier 1: Digi-Key; Height: 0.4mm; Package: 0402; value: 40.2K
R65 = RES 0 OHM JUMPER 1/16W 0402: Manufacturer: Yageo; Manufacturer Part Number: RC0402JR-070RL; Supplier Part Number 1: 311-0.0JRTR-ND; Package: 0402; Height: 0.4mm; Supplier 1: Digi-Key; value: 0
R69 = RES 121K OHM 1% 1/16W 0402: Manufacturer: YAGEO; Manufacturer Part Number: RC0402FR-07121KL; Supplier Part Number 1: 311-121KLRCT-ND; Supplier 1: Digi-Key; Height: 0.4mm; Package: 0402; value: 121K
R75 = RES 22.1K OHM 1% 1/16W 0402: Manufacturer: YAGEO; Manufacturer Part Number: RC0402FR-0722K1L; Supplier Part Number 1: 311-22.1KLRCT-ND; Supplier 1: Digi-Key; Height: 0.4mm; Package: 0402; value: 22.1K
SW5 = SW_OS102011MS2QS1: Switch Slide ON ON SPDT Top Slide 0.1A 12VDC 10000Cycle PC Pins Bracket Mount/Through Hole Bulk; Manufacturer: ITT C&K; Actuator Material: Polyoxymethylene,Acetal; Actuator Color: Black; Max Voltage Rating (DC): 12V; Electrical Life: 10000Cycles; Contact Current Rating: 100mA; Switch Travel: 2mm; Switch Function: On-On; Actuator Type: Standard; Actuator Length: 4mm; Contact Resistance: 20mR; Number of Positions: 2NUMBER; Supplier 1: Digi-Key; Manufacturer Part Number: OS102011MS2QS1; RoHS: Yes; Category: Slide Switches; Contact Material: Copper Alloy; Contact Plating: Silver,Gold; Min Operating Temperature: -30°C; Max Operating Temperature: 70°C; Throw Configuration: SPDT; Termination: PC Pin; Orientation: Straight; Voltage Rating (DC): 12V; Packaging: Bulk; Series: OS; RoHS Compliant: Yes; Reach SVHC Compliant: No; ComponentLink1URL: https://datasheet.ciiva.com/2889/os-19jan15-2889174.pdf?src-supplier=Digi-Key; ComponentLink1Description: https://datasheet.ciiva.com/2889/os-19jan15-2889174.pdf?src-supplier=Digi-Key; ComponentLink2URL: https://datasheet.ciiva.com/46420/1839844-46420507.pdf?src-supplier=Element14; ComponentLink2Description: https://datasheet.ciiva.com/46420/1839844-46420507.pdf?src-supplier=Element14; Supplier Part Number 1: CKN9542-ND; Stock: 72165; Pricing: 1=0.46000, 10=0.44800, 25=0.42200, 100=0.36630, 250=0.33228, 500=0.30910, 1000=0.27819, 2500=0.26119, 5000=0.24264 (USD); Mounting Technology: Through Hole,Brackets; Mechanical Life: 10000Cycles
T1-T8 = Test point PAD: test point
U7 = MYMGM1R816ELA5RA: Non-Isolated PoL Module DC DC Converter 1 Output 0.7 ~ 1.8V 16A 7.5V - 15V Input; Manufacturer: Murata; Supplier 1: Digi-Key; Manufacturer Part Number: MYMGM1R816ELA5RA; RoHS: Yes; Category: Board Mount Modules; Stock 1: 1799; Pricing 1: 1=11.04000, 5=10.30800, 10=9.94000, 25=9.20360 (USD); Supplier Part Number 1: 811-MYMGM1R816ELA5RACT-ND
U9 = MAX16914AUB+: Ideal Diode, Reverse-Battery, and Overvoltage Protection Switch/Limiter Controll; Manufacturer: Maxim; Max Supply Voltage: 19V; Max Power Dissipation: 707mW; Min Supply Voltage: 4.5V; Operating Supply Current: 29uA; Undervoltage Threshold: 4.35V; Watchdog Timer: No; Number of Monitored Inputs: 1; Reset Delay Time: 3us; Supplier 1: Mouser; Manufacturer Part Number: MAX16914AUB+; RoHS: Yes; Category: Battery Management; Stock 1: 2043; Pricing 1: 1=2.76000, 10=2.48000, 25=2.34000, 50=2.33000, 100=2.02000, 250=1.92000, 500=1.72000, 1000=1.55000, 2500=1.50000, 10000=1.50000 (USD); Mount: Surface Mount; Case/Package: UMAX; Number of Pins: 10; Min Operating Temperature: -40°C; Max Operating Temperature: 125°C; Packaging: Rail/Tube; Package Quantity: 1; Series: MAX16914; RoHS Compliant: Yes; ComponentLink1URL: https://datasheet.ciiva.com/24010/max16914-max16915-244836-24010084.pdf?src-supplier=Mouser; ComponentLink1Description: https://datasheet.ciiva.com/24010/max16914-max16915-244836-24010084.pdf?src-supplier=Mouser; Supplier Part Number 1: 700-MAX16914AUB+
U11 U13 = TPS62903RPJR: 3-V TO 17-V, 3-A, HIGH-EFFICIENC; Manufacturer: Texas Instruments; Supplier 1: Win Source Electronics; Manufacturer Part Number: TPS62903RPJR; RoHS: No; Category: Voltage Regulators - Switching; Supplier Part Number 1: 1127143-TPS62903RPJR
U12 = TPS54429ERSAT: IC REG BUCK ADJ 4.5A 16QFN; Manufacturer: Texas Instruments; Output Voltage: 5.5V; Number of Outputs: 1; Switching Frequency: 700kHz; Max Input Voltage: 18V; Min Input Voltage: 7V; Min Output Voltage: 760mV; Synchronous Rectifier: Yes; Quiescent Current: 600uA; Output Type: Adjustable; Output Configuration: Positive; Supplier 1: Digi-Key; Manufacturer Part Number: TPS54429ERSAT; RoHS: Yes; Category: Voltage Regulators - Switching; Stock 1: 475; Pricing 1: 1=2.97000, 10=2.66600, 25=2.51480, 100=2.14270 (USD); Case/Package: VQFN; Number of Pins: 16; Min Operating Temperature: -20°C; Max Operating Temperature: 85°C; Output Current: 4.5A; Packaging: Tape and Reel; Package Quantity: 250; Max Output Current: 4.5A; Max Output Voltage: 5.5V; Operating Supply Voltage: 18V; Series: SWIFT™, D-CAP2™, Eco-Mode™; Lead Free: Lead Free; RoHS Compliant: Yes; ComponentLink1URL: https://datasheet.ciiva.com/14378/slvsas0-14378171.pdf?src-supplier=Avnet; ComponentLink1Description: https://datasheet.ciiva.com/14378/slvsas0-14378171.pdf?src-supplier=Avnet; ComponentLink2URL: https://datasheet.ciiva.com/2035/tps54429e-2035525.pdf?src-supplier=Digi-Key; ComponentLink2Description: https://datasheet.ciiva.com/2035/tps54429e-2035525.pdf?src-supplier=Digi-Key; Supplier Part Number 1: 296-TPS54429ERSATCT-ND

## Sheet Power-2.SchDoc: =ProjectTitle
size A3; Author: Jaime I. Chait; Organization: NWES LLC; Address1: 111 SW 5th Ave, STE 3150; Address2: Portland, OR 97204; DocumentNumber: SCH-0001; Revision: 2; SheetNumber: 3; SheetTotal: 19
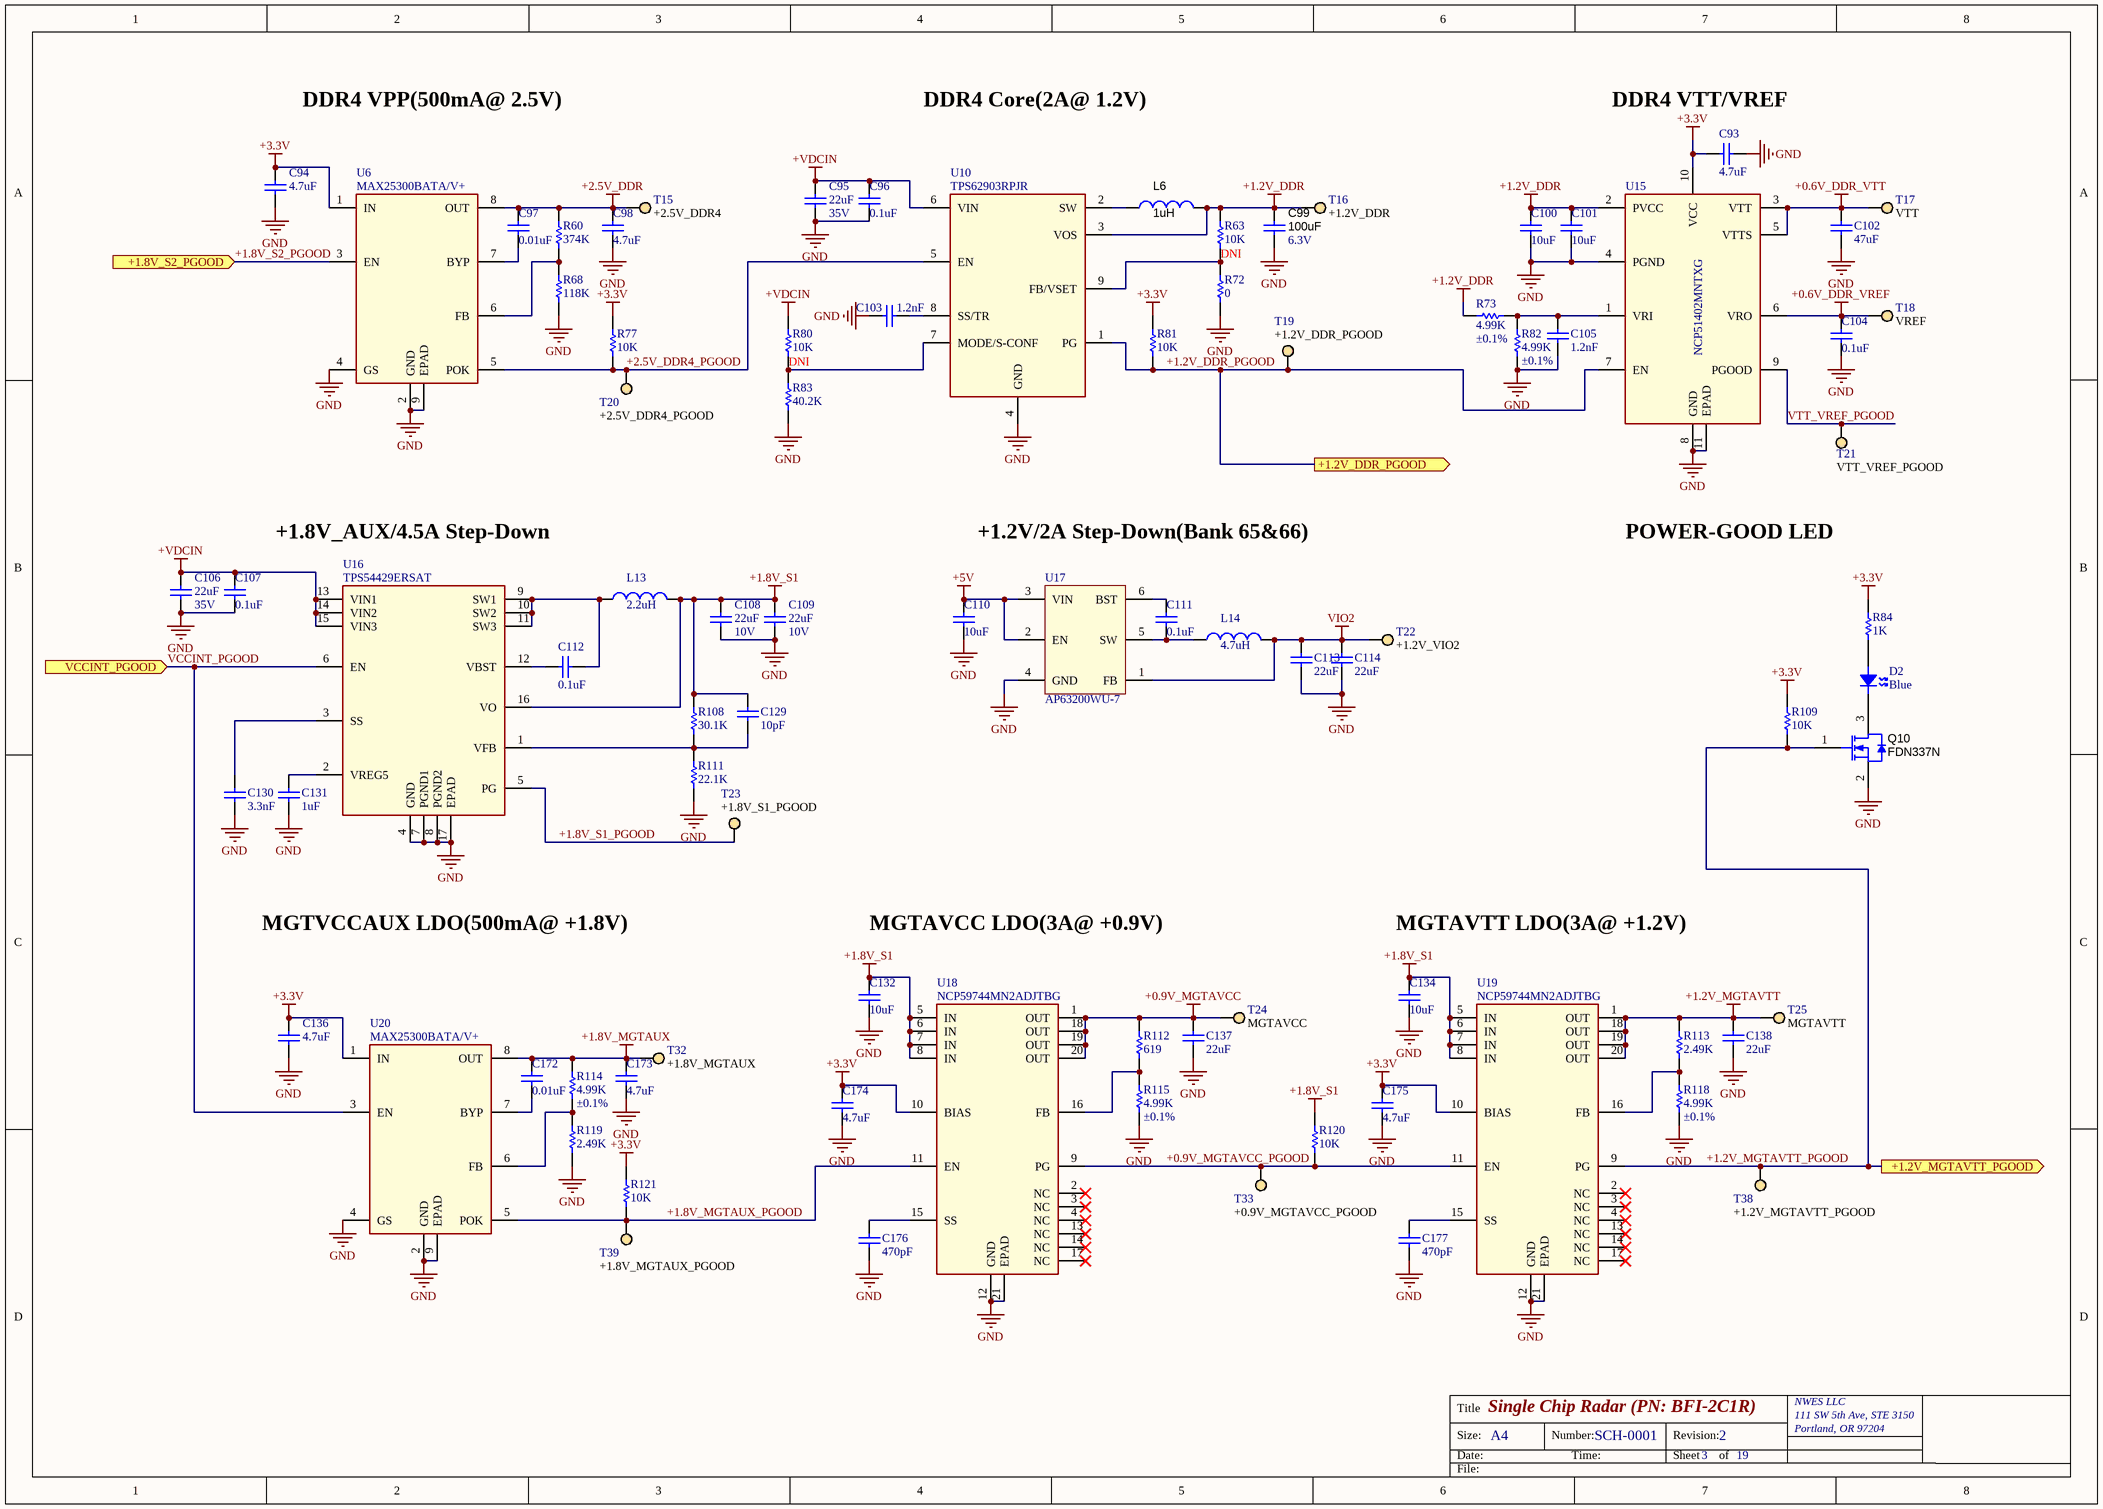
[diagram p12: Power-2.SchDoc]

### Parts
C93  4.7uF  [CAPC1005X65USR]
C94  4.7uF  [CAPC1005X65USR]
C95  22uF  Voltage Rating: 35V  [CAP-1206]
C96  0.1uF  [CAPC1005X55USR]
C97  0.01uF  [CAPC1005X55USR]
C98  4.7uF  [CAPC1005X65USR]
C99  100uF  Voltage Rating (DC): 6.3V  [CAPC3216X180N]
C100  10uF  [CAPC1005X90]
C101  10uF  [CAPC1005X90]
C102  47uF  [CAP-1206]
C103  1.2nF  [CAPC1005X55USR]
C104  0.1uF  [CAPC1005X55USR]
C105  1.2nF  [CAPC1005X55USR]
C106  22uF  Voltage Rating: 35V  [CAPC3216X180N]
C107  0.1uF  [CAPC1005X55USR]
C108  22uF  Voltage Rating: 10V  [CAPC1608X100N]
C109  22uF  Voltage Rating: 10V  [CAPC1608X100N]
C110  10uF  [CAPC1005X90]
C111  0.1uF  [CAPC1005X55USR]
C112  0.1uF  [CAPC1005X55USR]
C113  22uF  [CAPC1608X100N]
C114  22uF  [CAPC1608X100N]
C129  10pF  [CAPC1005X55USR]
C130  3.3nF  [CAPC1005X55USR]
C131  1uF  [CAPC1005X55USR]
C132  10uF  [CAPC1005X90]
C134  10uF  [CAPC1005X90]
C136  4.7uF  [CAPC1005X65USR]
C137  22uF  [CAPC1608X100N]
C138  22uF  [CAPC1608X100N]
C172  0.01uF  [CAPC1005X55USR]
C173  4.7uF  [CAPC1005X65USR]
C174  4.7uF  [CAPC1005X65USR]
C175  4.7uF  [CAPC1005X65USR]
C176  470pF  [CAPC1005X55USR]
C177  470pF  [CAPC1005X55USR]
D2  Blue  [LED_0603]
L6  1uH  [DFE252012P]
L13  2.2uH  [IND_SPM6530T-2R2M]
L14  4.7uH  [DFE252012P]
Q10  FDN337N  [SOT-23]
R60  374K  [RESC1005X40USR]
R63  10K  [RESC1005X40USR]
R68  118K  [RESC1005X40USR]
R72  0  [RESC1005X40USR]
R73  4.99K  Tolerance: ±0.1%  [RESC1005X40USR]
R77  10K  [RESC1005X40USR]
R80  10K  [RESC1005X40USR]
R81  10K  [RESC1005X40USR]
R82  4.99K  Tolerance: ±0.1%  [RESC1005X40USR]
R83  40.2K  [RESC1005X40USR]
R84  1K  [RESC1005X40USR]
R108  30.1K  [RESC1005X40USR]
R109  10K  [RESC1005X40USR]
R111  22.1K  [RESC1005X40USR]
R112  619  [RESC1005X40USR]
R113  2.49K  [RESC1005X40USR]
R114  4.99K  Tolerance: ±0.1%  [RESC1005X40USR]
R115  4.99K  Tolerance: ±0.1%  [RESC1005X40USR]
R118  4.99K  Tolerance: ±0.1%  [RESC1005X40USR]
R119  2.49K  [RESC1005X40USR]
R120  10K  [RESC1005X40USR]
R121  10K  [RESC1005X40USR]
T15  Parameter 1: +2.5V_DDR4  [TP_SM_1MM]  (hidden comment: TP_S)  (no BOM)
T16  Parameter 1: +1.2V_DDR  [TP_SM_1MM]  (hidden comment: TP_S)  (no BOM)
T17  Parameter 1: VTT  [TP_SM_1MM]  (hidden comment: TP_S)  (no BOM)
T18  Parameter 1: VREF  [TP_SM_1MM]  (hidden comment: TP_S)  (no BOM)
T19  Parameter 1: +1.2V_DDR_PGOOD  [TP_SM_1MM]  (hidden comment: TP_S)  (no BOM)
T20  Parameter 1: +2.5V_DDR4_PGOOD  [TP_SM_1MM]  (hidden comment: TP_S)  (no BOM)
T21  Parameter 1: VTT_VREF_PGOOD  [TP_SM_1MM]  (hidden comment: TP_S)  (no BOM)
T22  Parameter 1: +1.2V_VIO2  [TP_SM_1MM]  (hidden comment: TP_S)  (no BOM)
T23  Parameter 1: +1.8V_S1_PGOOD  [TP_SM_1MM]  (hidden comment: TP_S)  (no BOM)
T24  Parameter 1: MGTAVCC  [TP_SM_1MM]  (hidden comment: TP_S)  (no BOM)
T25  Parameter 1: MGTAVTT  [TP_SM_1MM]  (hidden comment: TP_S)  (no BOM)
T32  Parameter 1: +1.8V_MGTAUX  [TP_SM_1MM]  (hidden comment: TP_S)  (no BOM)
T33  Parameter 1: +0.9V_MGTAVCC_PGOOD  [TP_SM_1MM]  (hidden comment: TP_S)  (no BOM)
T38  Parameter 1: +1.2V_MGTAVTT_PGOOD  [TP_SM_1MM]  (hidden comment: TP_S)  (no BOM)
T39  Parameter 1: +1.8V_MGTAUX_PGOOD  [TP_SM_1MM]  (hidden comment: TP_S)  (no BOM)
U6  MAX25300BATA/V+  [8-TDFN-EP (2x2)]
U10  TPS62903RPJR  [9-VQFN-HR (1.5x2)]
U15  NCP51402MNTXG  [DFN10_3X3_ONS-M]
U16  TPS54429ERSAT  [16-QFN (4x4)]
U17  AP63200WU-7  [SOT95P280X100-6N]
U18  NCP59744MN2ADJTBG  [20-QFN (5x5)]
U19  NCP59744MN2ADJTBG  [20-QFN (5x5)]
U20  MAX25300BATA/V+  [8-TDFN-EP (2x2)]

### Ports
+1.2V_DDR_PGOOD (out), +1.2V_MGTAVTT_PGOOD (out), +1.8V_S2_PGOOD (in), VCCINT_PGOOD (in)